# EAGLE design Basic (EAGLE 7.3.0)
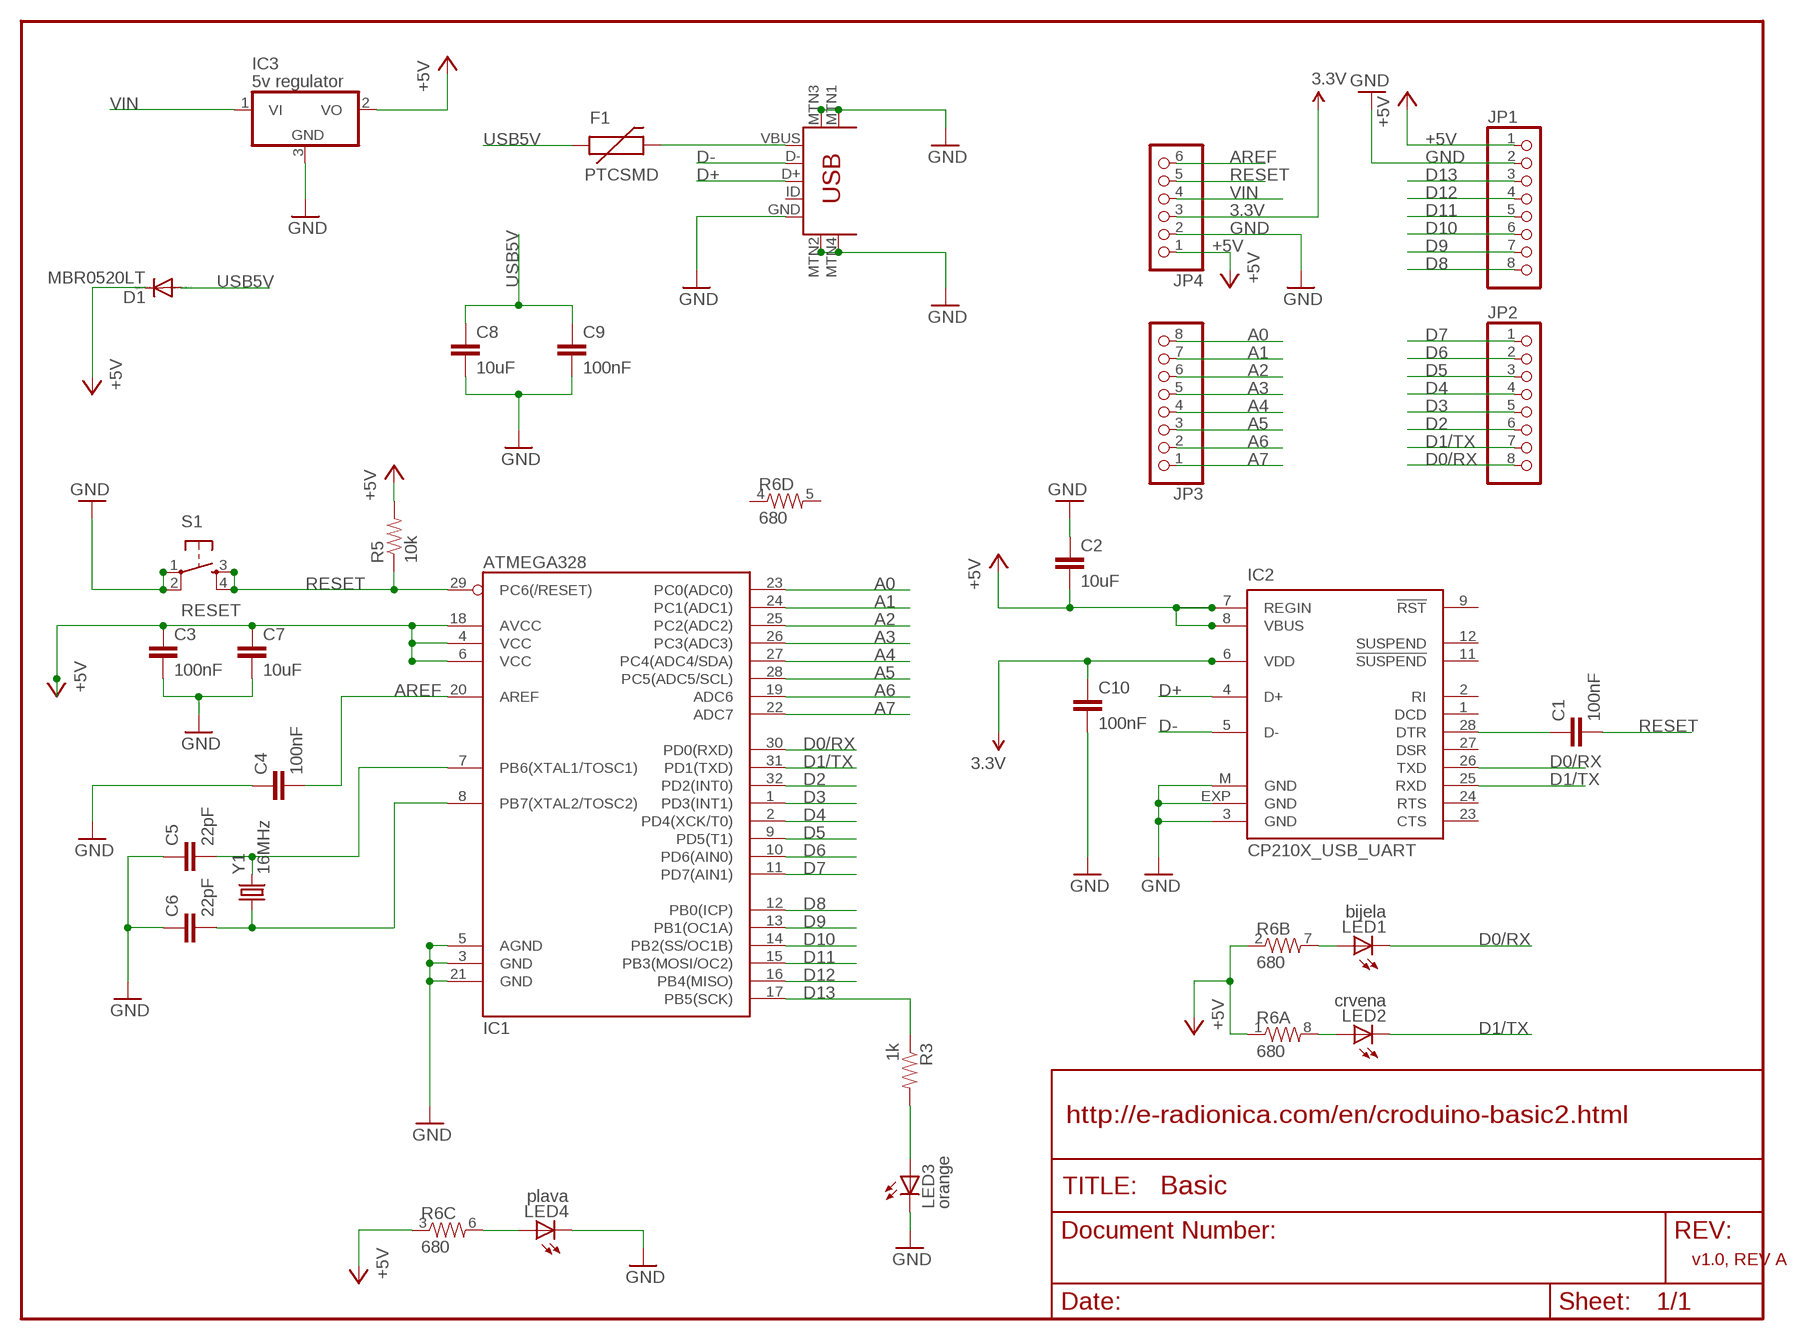
[diagram p0: schematic, sheet 1]

## Parts
C1  100nF  CAP0603-CAP  [0603-CAP]
C2  10uF  C-EUC3216  [C3216]
C3  100nF  CAP0603-CAP  [0603-CAP]
C4  100nF  CAP0603-CAP  [0603-CAP]
C5  22pF  CAP0603-CAP  [0603-CAP]
C6  22pF  CAP0603-CAP  [0603-CAP]
C7  10uF  C-EUC3216  [C3216]
C8  10uF  C-EUC3216  [C3216]
C9  100nF  CAP0603-CAP  [0603-CAP]
C10  100nF  CAP0603-CAP  [0603-CAP]
D1  MBR0520LT  [SOD123]
F1  PTCSMD  [PTC-1206]
IC1  ATMEGA328  ATMEGA168  [TQFP32-08]
IC2  CP210X_USB_UART  [MLP28]
IC3  5v regulator  7805DT  [TO252]
JP1  PINHD-1X8BIG  [1X08-BIG]
JP2  PINHD-1X8BIG  [1X08-BIG]
JP3  PINHD-1X8BIG  [1X08-BIG]
JP4  PINHD-1X6B  [1X06-BIG]
LED1  bijela  LEDCHIP-LED0805  [CHIP-LED0805]
LED2  crvena  LEDCHIP-LED0805  [CHIP-LED0805]
LED3  orange  LEDCHIP-LED0805  [CHIP-LED0805]
LED4  plava  LEDCHIP-LED0805  [CHIP-LED0805]
R3  1k  RESISTOR0603-RES  [0603-RES]
R5  10k  RESISTOR0603-RES  [0603-RES]
R6  680  RESISTOR-ARRAY0603-ARV  [0603-ARV]
S1  RESET  TAC_SWITCHSMD  [TACTILE_SWITCH_SMD]
U1  USB-MINIB  USB-MINIB-5PIN  [USB-MINIB]
Y1  16MHz  CRYSTAL5X3  [CRYSTAL-SMD-5X3]

## Nets
3.3V: C10.1 IC2.6(VDD) JP4.3
+5V: C2.2 C3.1 C7.1 D1.C IC1.4(VCC) IC1.6(VCC) IC1.18(AVCC) IC2.7(REGIN) IC2.8(VBUS) IC3.2(VO) JP1.1 JP4.1 R5.2 R6.1 R6.2 R6.3
A0: IC1.23(PC0(ADC0)) JP3.8
A1: IC1.24(PC1(ADC1)) JP3.7
A2: IC1.25(PC2(ADC2)) JP3.6
A3: IC1.26(PC3(ADC3)) JP3.5
A4: IC1.27(PC4(ADC4/SDA)) JP3.4
A5: IC1.28(PC5(ADC5/SCL)) JP3.3
A6: IC1.19(ADC6) JP3.2
A7: IC1.22(ADC7) JP3.1
AREF: C4.2 IC1.20(AREF) JP4.6
CRYSTAL1: C5.2 IC1.7(PB6(XTAL1/TOSC1)) Y1.3
CRYSTAL2: C6.2 IC1.8(PB7(XTAL2/TOSC2)) Y1.1
D0/RX: IC1.30(PD0(RXD)) IC2.26(TXD) JP2.8 LED1.C
D1/TX: IC1.31(PD1(TXD)) IC2.25(RXD) JP2.7 LED2.C
D2: IC1.32(PD2(INT0)) JP2.6
D3: IC1.1(PD3(INT1)) JP2.5
D4: IC1.2(PD4(XCK/T0)) JP2.4
D5: IC1.9(PD5(T1)) JP2.3
D6: IC1.10(PD6(AIN0)) JP2.2
D7: IC1.11(PD7(AIN1)) JP2.1
D8: IC1.12(PB0(ICP)) JP1.8
D9: IC1.13(PB1(OC1A)) JP1.7
D10: IC1.14(PB2(SS/OC1B)) JP1.6
D11: IC1.15(PB3(MOSI/OC2)) JP1.5
D12: IC1.16(PB4(MISO)) JP1.4
D13: IC1.17(PB5(SCK)) JP1.3 R3.1
D+: IC2.4(D+) U1.D+
D-: IC2.5(D-) U1.D-
GND: C2.1 C3.2 C4.1 C5.1 C6.1 C7.2 C8.2 C9.2 C10.2 IC1.3(GND) IC1.5(AGND) IC1.21(GND) IC2.3(GND) IC2.EXP(GND) IC2.M(GND) IC3.3(GND) JP1.2 JP4.2 LED3.C LED4.C S1.1 S1.2 U1.GND U1.MTN1(MTN2) U1.MTN2(MTN3) U1.MTN3(MTN1) U1.MTN4
N$1: LED1.A R6.7
N$2: LED2.A R6.8
N$6: F1.2 U1.VBUS
NAR_LED: LED3.A R3.2
PLV_LED: LED4.A R6.6
RESET: C1.2 IC1.29(PC6(/RESET)) JP4.5 R5.1 S1.3 S1.4
RST_PRIJE_KOND: C1.1 IC2.28(DTR)
USB5V: C8.1 C9.1 D1.A F1.1
VIN: IC3.1(VI) JP4.4
Unconnected: IC2.1(DCD) IC2.2(RI) IC2.9(!RST) IC2.11(!SUSPEND) IC2.12(SUSPEND) IC2.23(CTS) IC2.24(RTS) IC2.27(DSR) R6.4 R6.5 U1.ID

## Notes on the sheet
- http://e-radionica.com/en/croduino-basic2.html
- v1.0, REV A

## Library data of the parts
C1 C3-C6 C9 C10 = SparkFun:CAP: Capacitor Standard 0603 ceramic capacitor, and 0.1" leaded capacitor.
C2 C7 C8 = rcl:C-EU: CAPACITOR, European symbol
D1 = diode:MBR0520LT: SCHOTTKY BARRIER RECTIFIER Source: http://onsemi.com .. MBR0520LT1-D.pdf
F1 = SparkFun:PTC: Resettable Fuse PTC Resettable Fuse. Spark Fun Electronics SKU : COM-08357
IC1 = SparkFun:ATMEGA168
IC2 = SparkFun-DigitalIC:CP210X_USB_UART: Single-Chip USB to UART Bridge Source: www.silabs.com .. CP2101.pdf / cp2102.pdf. Spark Fun Electronics SKU : COM-00310
IC3 = adafruit:78*: Positive VOLTAGE REGULATOR Added bigger pads to the TO-92 package
JP1-JP3 = adafruit:PINHD-1X8: PIN HEADER
JP4 = adafruit:PINHD-1X6: PIN HEADER
LED1-LED4 = adafruit:LED: LED OSRAM: - CHIPLED LG R971, LG N971, LY N971, LG Q971, LY Q971, LO R971, LY R971 LH N974, LH R974 LS Q976, LO Q976, LY Q976 LO Q996 - Hyper CHIPLED LW Q18S LB Q993, LB Q99A, LB R99A - SideLED LS A670, LO A670, LY A670, LG A670, LP A670 LB A673, LV A673, LT A673, LW A673 LH A674 LY A675 LS A676, LA A676, LO A676, LY A676, LW A676 LS A679, LY A679, LG A679 - Hyper Micro SIDELED® LS Y876, LA Y876, LO Y876, LY Y876 LT Y87S - SmartLED LW L88C, LW L88S LB L89C, LB L89S, LG L890 LS L89K, LO L89K, LY L89K LS L896, LA L896, LO L896, LY L896 - TOPLED LS T670, LO T670, LY T670, LG T670, LP T670 LSG T670, LSP T670, LSY T670, LOP T670, LYG T670 LG T671, LOG T671, LSG T671 LB T673, LV T673, LT T673, LW T673 LH T674 LS T676, LA T676, LO T676, LY T676, LB T676, LH T676, LSB T676, LW T676 LB T67C, LV T67C, LT T67C, LS T67K, LO T67K, LY T67K, LW E67C LS E67B, LA E67B, LO E67B, LY E67B, LB E67C, LV E67C, LT E67C LW T67C LS T679, LY T679, LG T679 LS T770, LO T770, LY T770, LG T770, LP T770 LB T773, LV T773, LT T773, LW T773 LH T774 LS E675, LA E675, LY E675, LS T675 LS T776, LA T776, LO T776, LY T776, LB T776 LHGB T686 LT T68C, LB T68C - Hyper Mini TOPLED® LB M676 - Mini TOPLED Santana® LG M470 LS M47K, LO M47K, LY M47K Source: http://www.osram.convergy.de/
R3 R5 = SparkFun:RESISTOR: Resistor Basic schematic elements and footprints for 0603, 1206, and PTH resistors.
R6 = SparkFun:RESISTOR-ARRAY: Array Chip Resistor Source: RS Component / Phycomp
S1 = SparkFun:TAC_SWITCH: Momentary Switch Button commonly used for reset or general input. Spark Fun Electronics SKU : COM-00097
U1 = SparkFun:USB-MINIB: Mini-USB "B" connector with 5th pin broken out. Created new symbol breaking out 5th "ID" pin in mini/micro USB connector spec. See: http://en.wikipedia.org/wiki/Mini_usb#Cables. Uses same footprint as 4-pin symbol. Also added pins to connect to mounting / shield pads if required (probably not generally needed as signals aren't shielded once they leave the connector).
Y1 = SparkFun:CRYSTAL: Crystals Various standard crystals. Proven footprints. Spark Fun Electronics SKU : COM-00534

## Board
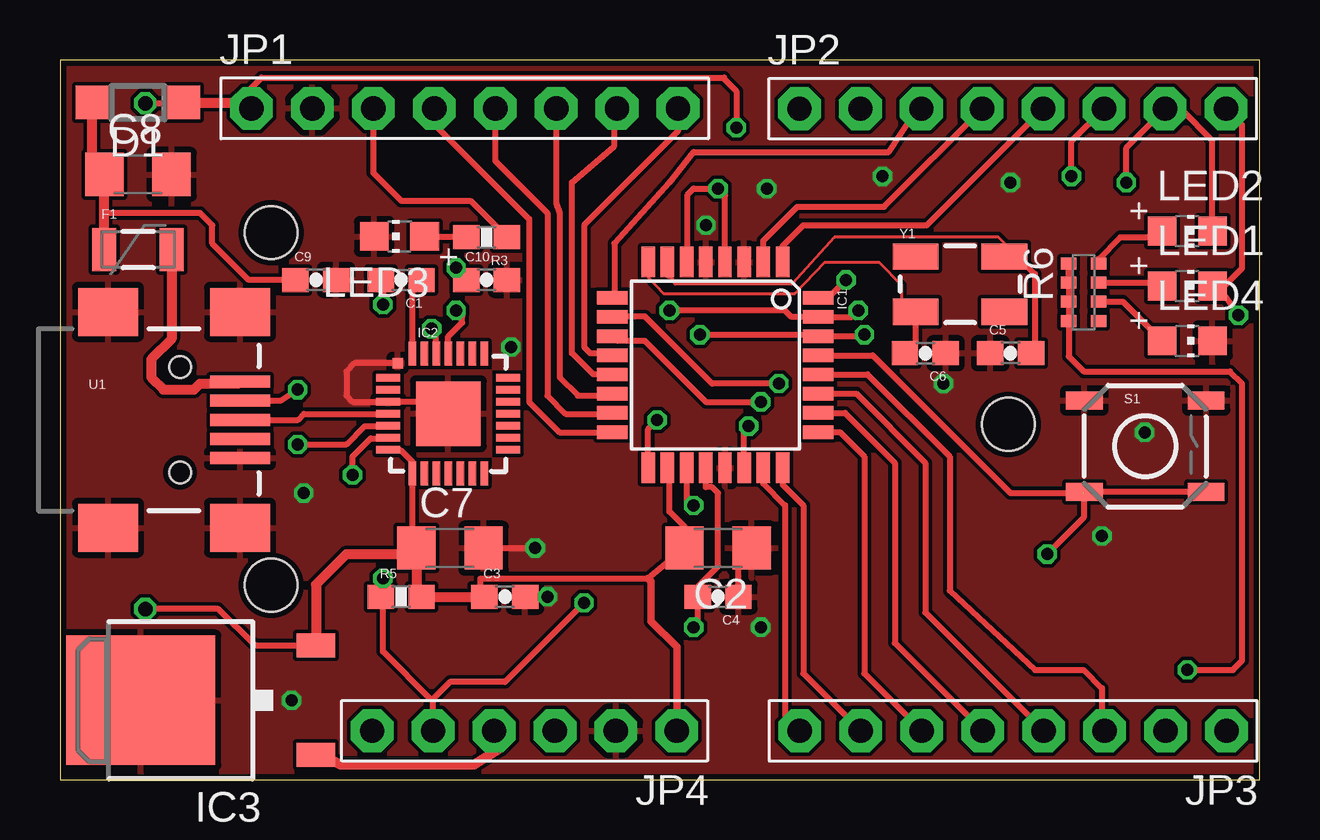
[diagram p1: board, top side]
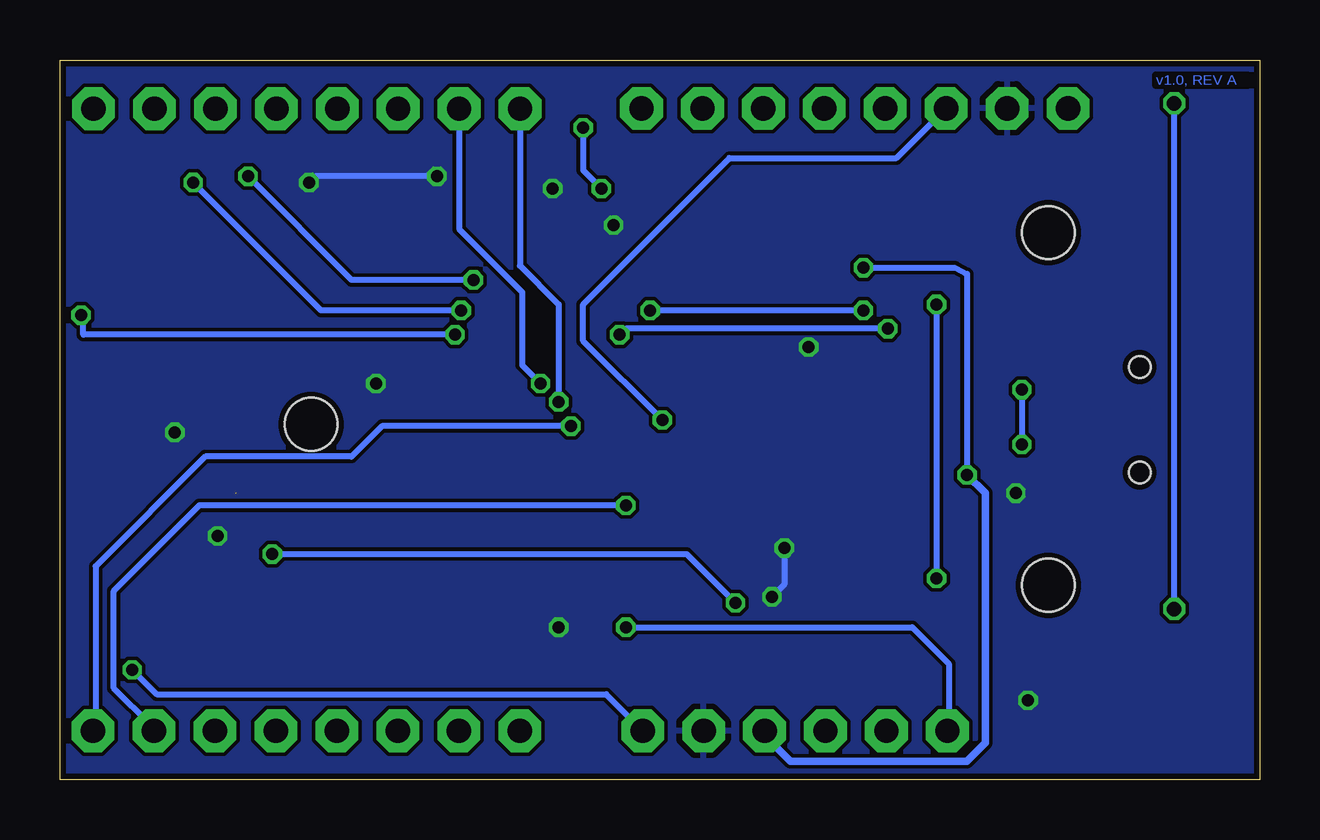
[diagram p2: board, bottom side, seen from below]

Size 50 x 30 mm. Coordinates in mm from the lower left corner, seen from the top.
Outline: 0,0 50,0 50,30 0,30 0,0
Copper layers (1*16): Top 0.035mm / dielectric 1.5mm / Bottom 0.035mm
Design rules "SeeedStudio_2layer_DRU_no_angle_20140221": minimum track width 6mil, minimum drill 12mil, track to track 6mil, track to pad 6mil, pad to pad 6mil, via to via 6mil, smd to smd 0mil, copper to edge 10mil, drill to drill 10mil, minimum pad ring 10mil, minimum via ring 6mil, stop-mask expansion 2mil, vias tented up to drill 100mil, thermal gap 10mil
Holes 2.2 mm at 8.8,22.8 39.53,14.81 8.8,8.1

### Footprints (pad centres in the part's own frame; a part is rotated, then mirrored left to right if it is on the bottom)
0603-CAP = smd 1.1 x 1: 1 -0.85,0; 2 0.85,0
C3216 = smd 1.6 x 1.8: 1 -1.4,0; 2 1.4,0
SOD123 = smd 1.4 x 1.4: A 1.9,0; C -1.9,0
PTC-1206 = smd 1 x 1.8: 1 -1.4,0; 2 1.4,0
TQFP32-08 = smd 1.27 x 0.559: 1 -4.293,2.8; 2 -4.293,2; 3 -4.293,1.2; 4 -4.293,0.4; 5 -4.293,-0.4; 6 -4.293,-1.2; 7 -4.293,-2; 8 -4.293,-2.8; 17 4.293,-2.8; 18 4.293,-2; 19 4.293,-1.2; 20 4.293,-0.4; 21 4.293,0.4; 22 4.293,1.2; 23 4.293,2; 24 4.293,2.8 | smd 0.559 x 1.27: 9 -2.8,-4.293; 10 -2,-4.293; 11 -1.2,-4.293; 12 -0.4,-4.293; 13 0.4,-4.293; 14 1.2,-4.293; 15 2,-4.293; 16 2.8,-4.293; 25 2.8,4.293; 26 2,4.293; 27 1.2,4.293; 28 0.4,4.293; 29 -0.4,4.293; 30 -1.2,4.293; 31 -2,4.293; 32 -2.8,4.293
MLP28 = smd 1 x 0.3: 1 -2.5,1.5; 2 -2.5,1; 3 -2.5,0.5; 4 -2.5,0; 5 -2.5,-0.5; 6 -2.5,-1; 7 -2.5,-1.5; 15 2.5,-1.5; 16 2.5,-1; 17 2.5,-0.5; 18 2.5,0; 19 2.5,0.5; 20 2.5,1; 21 2.5,1.5 | smd 0.3 x 1: 8 -1.5,-2.5; 9 -1,-2.5; 10 -0.5,-2.5; 11 0,-2.5; 12 0.5,-2.5; 13 1,-2.5; 14 1.5,-2.5; 22 1.5,2.5; 23 1,2.5; 24 0.5,2.5; 25 0,2.5; 26 -0.5,2.5; 27 -1,2.5; 28 -1.5,2.5 | smd 2.7 x 2.7: EXP 0,0 | smd 0.435 x 0.435: M -2.103,2.103
TO252 = smd 1 x 1.6: 1 -2.28,-4.8; 2 2.28,-4.8 | smd 5.4 x 6.2: 3 0,2.5
1X08-BIG = drill 1.016 pad 1.778 octagon: 1 -8.89,0; 2 -6.35,0; 3 -3.81,0; 4 -1.27,0; 5 1.27,0; 6 3.81,0; 7 6.35,0; 8 8.89,0
1X06-BIG = drill 1.016 pad 1.778 octagon: 1 -6.35,0; 2 -3.81,0; 3 -1.27,0; 4 1.27,0; 5 3.81,0; 6 6.35,0
CHIP-LED0805 = smd 1.2 x 1.2: A 0,-1.05; C 0,1.05
0603-RES = smd 1.1 x 1: 1 -0.85,0; 2 0.85,0
0603-ARV = smd 0.5 x 0.65: 1 -1.2,-0.625; 2 -0.4,-0.625; 3 0.4,-0.625; 4 1.2,-0.625; 5 1.2,0.625; 6 0.4,0.625; 7 -0.4,0.625; 8 -1.2,0.625
TACTILE_SWITCH_SMD = smd 1.524 x 0.762: 1 -2.54,1.905; 2 2.54,1.905; 3 -2.54,-1.905; 4 2.54,-1.905
USB-MINIB = smd 2.5 x 0.5: D+ 2.5,0; D- 2.5,0.8; GND 2.5,-1.6; ID 2.5,-0.8; VBUS 2.5,1.6 | smd 2.5 x 2: MTN1 -3,4.5; MTN2 2.5,4.5; MTN3 -3,-4.5; MTN4 2.5,-4.5 | hole 0.9: 0,2.2; 0,-2.2
CRYSTAL-SMD-5X3 = smd 1.9 x 1.1: 1 -1.85,-1.15; 2 1.85,-1.15; 3 1.85,1.15; 4 -1.85,1.15

### Placement (x,y rotation side)
C1  14.22,20.83 180 top
C2  27.43,9.65 180 top
C3  18.54,7.62 0 top
C4  27.43,7.62 180 top
C5  39.62,17.78 0 top
C6  36.07,17.78 180 top
C7  16.26,9.65 0 top
C8  3.25,25.23 0 top
C9  10.67,20.83 0 top
C10  17.78,20.83 0 top
D1  3.25,28.23 180 top
F1  3.25,22.1 0 top
IC1  27.32,17.29 270 top
IC2  16.18,15.25 0 top
IC3  5.87,3.31 90 top
JP1  16.87,27.99 0 top
JP2  39.71,27.97 0 top
JP3  39.73,2.03 180 top
JP4  19.36,2.03 180 top
LED1  46.99,20.57 270 top
LED2  46.99,22.86 270 top
LED3  14.15,22.64 90 top
LED4  46.99,18.29 270 top
R3  17.78,22.61 180 top
R5  14.22,7.62 0 top
R6  42.67,20.32 270 top
S1  45.24,13.89 0 top
U1  5,15 0 top
U$1  [BASIC2_LED]  0.12,17.02 0 top
U$2  [BASIC2_ANALOG]  -0.51,-0.25 0 top
U$3  [BASIC2_ANALOG2]  0,0 0 top
U$4  [BASIC2_DIGITAL]  -0.76,22.61 0 top
U$5  [BASIC2_DIGITAL2]  0,22.61 0 top
U$6  [NOVI_LOGO-4MM]  2.29,13.21 0 top
U$7  [NOVI_LOGO-4MM]  44.96,6.86 0 top
U$8  [CRODUINO_BASIC2]  38.1,6.35 0 top
U$9  [BASIC2_BOTTOM]  0,0 0 top
Y1  37.52,20.65 0 top

### Tracks (layer width: path | path; a pad name or v marks a point on that pad's centre or on a via)
3.3V  (via drill 0.5)
  Top 0.254: C10.1 16.76,20.83 v16.51,21.34 | v12.19,12.7 12.19,13.46 12.95,14.22 13.65,14.22 IC2.6
  Bottom 0.254: v16.51,21.34 12.7,21.34 12.19,21.08 v12.19,12.7 | JP4.3 20.63,1.84
  Bottom 0.305: 20.63,1.84 19.56,0.76 12.19,0.76 11.43,1.52 11.43,11.94 v12.19,12.7
+5V  (via drill 0.5, 0.6)
  Top 0.254: IC2.7 13.72,13.72 14.22,13.72 14.68,13.26 IC2.8 14.68,9.82 C7.1 | R6.3 42.16,20.04 42.16,20.57 42.05,20.69 R6.2 R6.1 42.05,17.64 42.67,17.02 48.77,17.02 49.28,16.51 49.28,4.96 48.89,4.57 v46.99,4.57 | C3.1 17.53,7.62 17.53,8.38 24.51,8.38 C2.2 26.03,10.54 25.4,11.18 25.4,12.91 IC1.18 | 26.16,21.54 IC1.6 26.16,21.62 26.16,24.38 26.42,24.64 v27.43,24.64 27.72,24.35 IC1.4 | JP1.1 7.98,28.3 | IC3.2 8.13,5.59 6.6,7.11 v3.56,7.11 | D1.C 5.3,28.23 5.33,28.19 5.33,28.7 4.83,28.19 v3.56,28.19 | 7.37,28.23 8.4,29.26 27.69,29.26 27.69,29.21 28.19,28.7 v28.19,27.18
  Top 0.305: JP4.1 25.71,5.53 24.64,6.6 24.64,8.25 24.51,8.38
  Top 0.406: D1.C 7.37,28.23 7.98,28.23 JP1.1 | C3.1 R5.2 14.86,7.84 C7.1 14.6,9.4 11.94,9.4 10.67,8.13 10.67,5.61 IC3.2 10.67,5.63
  Bottom 0.254: v28.19,27.18 28.19,25.4 v27.43,24.64 | JP4.1 27.24,3.56 45.97,3.56 v46.99,4.57 | v3.56,7.11 v3.56,28.19
A0
  Top 0.254: IC1.23 29.32,12.34 30.23,11.43 30.23,2.65 JP3.8
A1
  Top 0.254: IC1.24 30.12,12.3 30.99,11.43 30.99,4.42 JP3.7
A2
  Top 0.254: IC1.25 32.5,14.49 33.53,13.46 33.53,4.42 JP3.6
A3
  Top 0.254: IC1.26 32.72,15.29 34.8,13.21 34.8,5.69 JP3.5
A4
  Top 0.254: IC1.27 33.19,16.09 36.07,13.21 36.07,6.96 JP3.4
A5
  Top 0.254: IC1.28 33.66,16.89 37.08,13.46 37.08,7.87 40.64,4.57 42.67,4.57 43.43,3.81 43.43,2.14 JP3.3
A6  (via drill 0.5)
  Top 0.254: IC1.19 26.12,11.47 v26.42,11.43
  Bottom 0.254: v26.42,11.43 44.2,11.43 47.75,7.87 47.75,3.81 46.23,2.29 46.23,2.18 JP3.2
A7  (via drill 0.5)
  Top 0.254: IC1.22 28.52,14.91 v28.7,14.73
  Bottom 0.254: JP3.1 48.51,2.14 48.51,8.89 43.94,13.46 37.85,13.46 36.58,14.73 v28.7,14.73
AREF  (via drill 0.5)
  Top 0.254: IC1.20 26.92,12.19 27.18,12.19 27.43,11.94 27.43,8.89 26.58,8.04 C4.2 26.58,6.52 v26.42,6.35
  Bottom 0.254: v26.42,6.35 14.48,6.35 12.95,4.83 12.95,2.09 JP4.6
CRYSTAL1
  Top 0.127: Y1.3 39.37,22.36 39.12,22.61 32.28,22.61 30.5,20.65 25.65,20.65 25.4,21.08
  Top 0.254: Y1.3 39.92,21.8 40.64,21.08 40.64,17.95 C5.2
  Top 0.406: 25.4,21.08 25.4,21.5 IC1.7
CRYSTAL2
  Top 0.127: IC1.8 24.52,20.95 25.15,20.27 30.63,20.27 31.88,21.57 34.14,21.57 35.08,20.62 35.08,19.96 Y1.1
  Top 0.254: Y1.1 35.67,18.23 C6.2
D0/RX  (via drill 0.5)
  Top 0.254: IC2.26 15.68,18.61 v15.49,18.8 | v26.67,18.54 31.56,18.54 IC1.30 33.47,18.49 v33.53,18.54 | v49.12,19.36 48.27,20.57 LED1.C 48.53,20.57 49.28,21.32 49.28,27.29 JP2.8
  Bottom 0.254: v15.49,18.8 26.42,18.8 v26.67,18.54 | v33.53,18.54 49.02,18.54 49.02,19.26 v49.12,19.36
D1/TX  (via drill 0.5)
  Top 0.254: LED2.C 48.04,26.64 46.74,27.94 46.09,27.94 JP2.7 44.45,26.35 v44.45,24.89 | 16.44,19.49 v16.51,19.56 16.76,19.3 16.76,19.05 16.18,18.47 IC2.25 | v25.4,19.56 30.23,19.56 30.5,19.29 IC1.31 33,19.29 v33.27,19.56
  Bottom 0.254: v16.51,19.56 v25.4,19.56 | v33.27,19.56 39.12,19.56 v44.45,24.89
D2  (via drill 0.5)
  Top 0.254: IC1.32 32.02,20.09 v32.77,20.83 | v42.16,25.15 42.16,26.61 JP2.6
  Bottom 0.254: v32.77,20.83 37.85,20.83 v42.16,25.15
D3
  Top 0.254: IC1.1 30.12,22.25 30.99,23.11 36.13,23.11 JP2.5
D4
  Top 0.254: IC1.2 29.32,22.46 30.73,23.88 34.35,23.88 JP2.4
D5
  Top 0.254: IC1.9 23.11,20.17 23.11,22.35 25.4,24.89 26.42,26.16 34.54,26.16 35.56,27.69 35.81,27.88 JP2.3
D6  (via drill 0.5)
  Top 0.254: IC1.10 23.05,19.3 24.38,19.3 27.18,16.51 v29.97,16.51
  Bottom 0.254: JP2.2 33.36,22.95 30.73,20.32 30.73,17.27 v29.97,16.51
D7  (via drill 0.5)
  Top 0.254: IC1.11 23.23,18.29 24.38,18.29 26.92,15.75 v29.21,15.75
  Bottom 0.254: JP2.1 30.82,21.43 29.21,19.81 v29.21,15.75
D8
  Top 0.254: JP1.8 25.76,27.03 21.84,23.11 21.84,18.03 22.1,17.78 22.93,17.78 IC1.12
D9
  Top 0.254: IC1.13 22.23,16.89 21.34,17.78 21.34,24.89 23.11,26.42 23.11,27.88 JP1.7
D10
  Top 0.254: JP1.6 20.68,24.02 20.83,23.62 20.83,16.76 21.59,16 22.94,16 IC1.14
D11
  Top 0.254: JP1.5 18.14,25.8 20.32,23.62 20.32,16 21.08,15.24 22.98,15.24 IC1.15
D12
  Top 0.254: JP1.4 15.6,27.33 19.56,23.37 19.56,15.75 20.83,14.48 23.02,14.48 IC1.16
D13  (via drill 0.5)
  Top 0.157: 18.8,22.61 R3.1
  Top 0.254: JP1.3 13.06,25.29 14.22,24.13 17.11,24.13 R3.1 | IC1.17 24.52,14.61 v24.89,14.99
  Bottom 0.254: v24.89,14.99 28.19,18.29 28.19,19.81 22.1,25.91 15.14,25.91 JP1.3
D+
  Top 0.254: U1.D+ 9.92,15 10.16,15.24 IC2.4
D-  (via drill 0.5)
  Top 0.254: U1.D- 9.2,15.8 v9.91,16.26 | v9.91,13.97 11.94,13.97 12.7,14.73 13.66,14.73 IC2.5
  Bottom 0.254: v9.91,16.26 v9.91,13.97
GND  (via drill 0.5)
  Top 0.254: IC2.EXP 15.68,15.75 IC2.3 12.19,15.75 11.94,16 11.94,17.02 12.28,17.36 IC2.M | C7.2 v19.81,9.65 | v20.32,7.62 C3.2 | C4.1 28.28,9.1 C2.1
  Bottom 0.254: v19.81,9.65 19.81,8.13 v20.32,7.62 | 34.54,25.15 39.37,25.15
  other vias: 10.16,11.94 9.65,3.3 18.8,18.03 29.46,24.64 26.92,23.11 29.21,6.35 39.62,24.89 45.21,14.48 36.83,16.51 34.29,25.15 43.43,10.16
  pour Top: 0,0 50.04,0 50.04,29.97 0,29.97 0,0.25
  pour Bottom: 0,0 50.04,0 50.04,29.97 0,29.97
N$1
  Top 0.254: R6.7 45.79,20.72 LED1.A
N$2
  Top 0.254: R6.8 43.3,21.71 44.2,22.61 45.69,22.61 LED2.A
N$6
  Top 0.406: F1.2 4.65,18.37 3.81,17.53 3.81,16.76 4.32,16.26 5.59,16.26 5.84,16.51 7.41,16.51 U1.VBUS
NAR_LED
  Top 0.254: LED3.A 16.89,22.64 R3.2
PLV_LED
  Top 0.254: R6.6 44.31,19.92 LED4.A
RESET  (via drill 0.5)  (1 unrouted)
  Top 0.254: JP4.5 15.55,3.24 15.49,3.3 | 15.49,3.3 13.46,5.33 13.46,7.53 R5.1 13.37,8.38 v13.46,8.38 | S1.4 S1.3 42.65,11.94 39.62,11.94 33.88,17.69 IC1.29 | C1.2 13.46,20.83 v13.46,19.81 | 42.67,11.94 42.67,10.92 v41.15,9.4 | v21.84,7.37 18.54,4.06 16.26,4.06 15.49,3.3
  Bottom 0.254: v13.46,19.81 v13.46,8.38 | v41.15,9.4 23.88,9.4 v21.84,7.37
RST_PRIJE_KOND
  Top 0.254: C1.1 14.68,20.83 IC2.28
USB5V
  Top 0.254: C9.1 7.87,20.83 6.35,22.35 6.35,23.11 5.84,23.62 1.85,23.62
  Top 0.406: F1.1 1.85,23.62 C8.1 1.35,25.23 D1.A
VIN
  Top 0.406: IC3.1 10.91,1.03 11.68,0.64 17.27,0.64 18.29,1.27 18.29,1.84 JP4.4

### Text on the board
Bottom: v1.0, REV A
200bmp: 16MHz | 2015, v1.0 / REV A